# Altium schematic sheet 5_Sensors.schdoc
size 309 x 223 mm; Symbol: Sheet-Symbol_A4; Device: Sheet-Symbol_A4; Company: EasyEDA.com; Drawed: EasyEDA Pro; Reviewed: EasyEDA Pro; Version: V0.1; Page Size: A4; @Project Name: Robomama_ver000; @Page Count: 5; @Update Date: 2024-01-21; @Create Date: 2024-01-14; @Schematic Name: Robomama_Schematic; Part Number: JLCPCB-002; @Page No: 5; @Page Name: Sensors
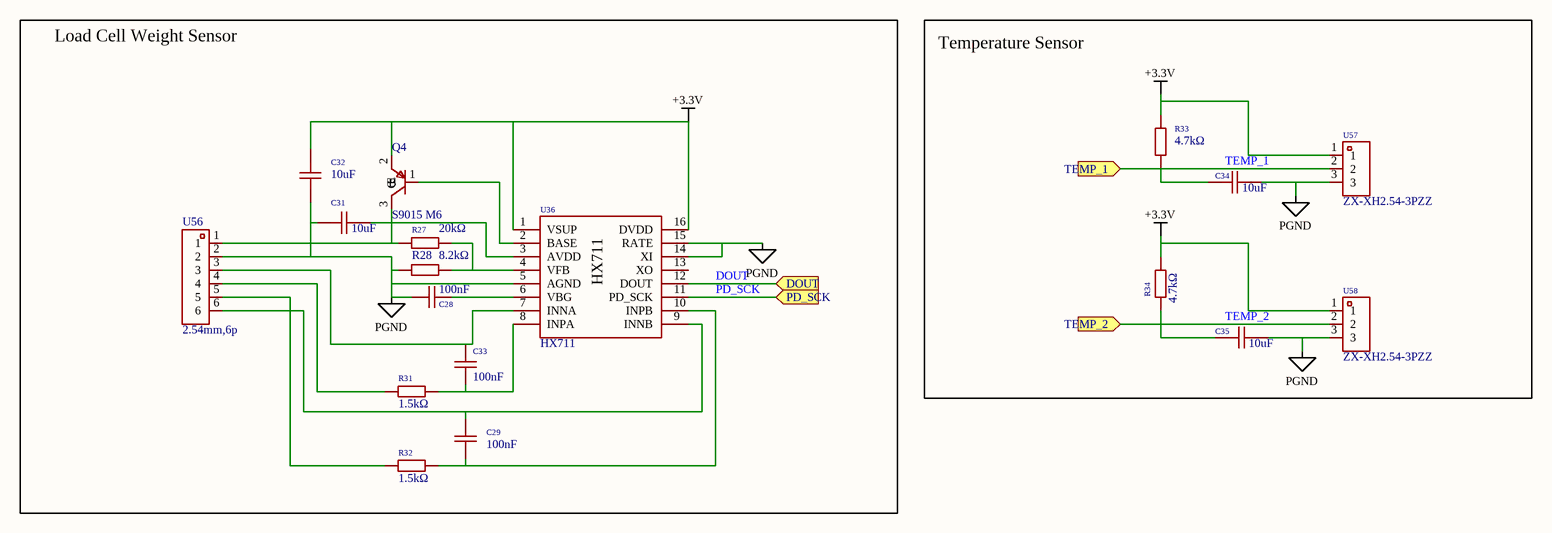
[diagram p0: 5_Sensors.schdoc]

## Parts
C28  100nF  [C0603]  (value not drawn)
C29  100nF  [C0603]  (value not drawn)
C31  10uF  [C0603]  (value not drawn)
C32  10uF  [C0603]  (value not drawn)
C33  100nF  [C0603]  (value not drawn)
C34  10uF  [C0603]  (value not drawn)
C35  10uF  [C0603]  (value not drawn)
Q4  S9015 M6  [SOT-23-3_L2.9-W1.3-P1.90-LS2.4-BR]  (value not drawn)
R27  20kΩ  [R0603]  (value not drawn)
R28  8.2kΩ  [R0603]  (value not drawn)
R31  1.5kΩ  [R0402]  (value not drawn)
R32  1.5kΩ  [R0402]  (value not drawn)
R33  4.7kΩ  [R0402]  (value not drawn)
R34  4.7kΩ  [R0402]  (value not drawn)
U36  HX711  [SOP-16_L10.0-W3.9-P1.27-LS6.0-BL]  (value not drawn)
U56  2.54mm,6p  [HDR-TH_6P-P2.54-V-M-A]  (value not drawn)
U57  ZX-XH2.54-3PZZ  [CONN-TH_3P-P2.54_2501S-3P]  (value not drawn)
U58  ZX-XH2.54-3PZZ  [CONN-TH_3P-P2.54_2501S-3P]  (value not drawn)

## Blocks framed on the sheet
Load Cell Weight Sensor: C28 C29 C31-C33 Q4 R27 R28 R31 R32 U36 U56
Temperature Sensor: C34 C35 R33 R34 U57 U58

## Ports
DOUT (in), PD_SCK (in), TEMP_1 (in), TEMP_2 (in)

## Nets
+3.3V: C32.2 Q4.2(E) R33.1 R34.2 U36.1(VSUP) U36.16(DVDD) U57.1 U58.1
PGND: C28.1 C31.1 C32.1 C34.2 C35.2 R28.1 U36.5(AGND) U36.14(XI) U36.15(RATE) U56.2 U57.3 U58.3
DOUT: U36.12(DOUT) ; port DOUT
PD_SCK: U36.11(PD_SCK) ; port PD_SCK
TEMP_1: C34.1 R33.2 U57.2 ; port TEMP_1
TEMP_2: C35.1 R34.1 U58.2 ; port TEMP_2
NetC28_2: C28.2 U36.6(VBG)
NetC29_1: C29.1 R32.2 U36.10(INPB)
NetC29_2: C29.2 U36.9(INNB) U56.6
NetC31_2: C31.2 Q4.3(C) R27.1 U36.3(AVDD) U56.1
NetC33_1: C33.1 R31.2 U36.8(INPA)
NetC33_2: C33.2 U36.7(INNA) U56.3
NetQ4_1: Q4.1(B) U36.2(BASE)
NetR27_2: R27.2 R28.2 U36.4(VFB)
NetR31_1: R31.1 U56.4
NetR32_1: R32.1 U56.5

Not connected (* = marked no-connect by the designer): U36 13(XO)

## Notes on the sheet
- 1
- 2
- 3
- 4
- 5
- 6
- A
- B
- C
- Schematic
- Robomama_Schematic
- Create Date
- Update Date
- 2024-01-21
- 2024-01-14
- Reviewed
- Drawed
- Page
- EasyEDA Pro
- Sensors
- Part Number
- Robomama_ver000
- JLCPCB-002
- D
- VER
- SIZE
- PAGE
- OF
- V0.1
- A4
- EasyEDA.com

## Library data of the parts
C28 C29 C33 = 0603B104K500NT_C30926: Capacitance: Tolerance:±10% Tolerance:±10% Voltage Rated: Temperature Coefficient:; Manufacturer: FH(风华); Add into BOM: yes; Tolerance: ±10%; Symbol: 0603B104K500NT; Device: 0603B104K500NT_C30926; Supplier: LCSC; Manufacturer Part: 0603B104K500NT; Value: 100nF; Supplier Part: C30926; JLCPCB Part Class: Extended Part; LCSC Part Name: 100nF ±10% 50V; Supplier Footprint: 0603; Datasheet: https://atta.szlcsc.com/upload/public/pdf/source/20200305/C486355_26A10D38EF8C2A5C37091D0039909270.pdf; Convert to PCB: yes
C31 C32 C34 C35 = CL10A106KP8NNNC: Capacitance: Tolerance:±10% Tolerance:±10% Voltage Rated: Temperature Coefficient:; Manufacturer: SAMSUNG(三星); Add into BOM: yes; Tolerance: ±10%; Symbol: CL10A106KP8NNNC; Device: CL10A106KP8NNNC; Supplier: LCSC; Manufacturer Part: CL10A106KP8NNNC; Value: 10uF; Supplier Part: C19702; JLCPCB Part Class: Basic Part; LCSC Part Name: 10uF ±10% 10V; Supplier Footprint: 0603; Datasheet: https://atta.szlcsc.com/upload/public/pdf/source/20160218/1457707763339.pdf; Convert to PCB: yes
Q4 = S9015 M6: Manufacturer: FOSAN(富信); Symbol: S9015_C2926163; Add into BOM: yes; Device: S9015 M6; LCSC Part Name: S9015; Supplier Part: C2926163; Manufacturer Part: S9015 M6; Supplier Footprint: SOT-23; JLCPCB Part Class: Extended Part; Datasheet: https://atta.szlcsc.com/upload/public/pdf/source/20211203/8DB34000D1917A417492DF38B82ACEC8.pdf; Supplier: LCSC; Convert to PCB: yes
R27 = 0603WAF2002T5E: Resistance:20000Ω Tolerance:±1% Tolerance:±1% Power(Watts): Overload Voltage (Max): Temperature Coefficient:±100ppm/℃ Temperature Coefficient:±100ppm/℃ Type:Thick Film Resistors Operating Temperature Range:-55℃~+155℃ Operating Temperature Range:-55℃~+155℃; Manufacturer: UNI-ROYAL(厚声); Add into BOM: yes; Tolerance: ±1%; Symbol: 0603WAF2002T5E; Device: 0603WAF2002T5E; Supplier: LCSC; Manufacturer Part: 0603WAF2002T5E; Supplier Part: C4184; Value: 20kΩ; JLCPCB Part Class: Basic Part; LCSC Part Name: 20kΩ ±1% 100mW 厚膜电阻; Supplier Footprint: 0603; Datasheet: https://atta.szlcsc.com/upload/public/pdf/source/20200306/C422600_1E6D84923E4A46A82E41ADD87F860B5C.pdf; Convert to PCB: yes; Temperature Coefficient: ±100ppm/℃; Type: Thick Film Resistors; Operating Temperature Range: -55℃~+155℃
R28 = RC0603FR-078K2L: Type:Thick Film Resistors Resistance: Tolerance:±1% Tolerance:±1% Power(Watts): Temperature Coefficient:±100ppm/℃ Temperature Coefficient:±100ppm/℃ Overload Voltage (Max): Operating Temperature Range:-55℃~+155℃ Operating Temperature Range:-55℃~+155℃; Manufacturer: YAGEO(国巨); Add into BOM: yes; Tolerance: ±1%; Symbol: RC0603FR-078K2L; Device: RC0603FR-078K2L; LCSC Part Name: 8.2kΩ ±1% 100mW; Supplier Part: C114637; Manufacturer Part: RC0603FR-078K2L; Supplier Footprint: 0603; JLCPCB Part Class: Extended Part; Datasheet: https://atta.szlcsc.com/upload/public/pdf/source/20170912/C114637_1505207799594963452.pdf; Supplier: LCSC; Convert to PCB: yes; Type: Thick Film Resistors; Value: 8.2kΩ; Temperature Coefficient: ±100ppm/℃; Operating Temperature Range: -55℃~+155℃
R31 R32 = 0402WGJ0152TCE: Resistance:1500Ω Tolerance:±5% Tolerance:±5% Power(Watts): Overload Voltage (Max): Temperature Coefficient:±100ppm/℃ Temperature Coefficient:±100ppm/℃ Type:Thick Film Resistors Operating Temperature Range:-55℃~+155℃ Operating Temperature Range:-55℃~+155℃; Manufacturer: UNI-ROYAL(厚声); Add into BOM: yes; Tolerance: ±5%; Symbol: 0402WGJ0152TCE; Device: 0402WGJ0152TCE; Supplier: LCSC; Manufacturer Part: 0402WGJ0152TCE; Supplier Part: C25930; Value: 1.5kΩ; JLCPCB Part Class: Extended Part; LCSC Part Name: 1.5kΩ ±5% 62.5mW 厚膜电阻; Supplier Footprint: 0402; Datasheet: https://atta.szlcsc.com/upload/public/pdf/source/20200306/C422600_1E6D84923E4A46A82E41ADD87F860B5C.pdf; Convert to PCB: yes; Temperature Coefficient: ±100ppm/℃; Type: Thick Film Resistors; Operating Temperature Range: -55℃~+155℃
R33 R34 = 0402WGF4701TCE: Resistance:4700Ω Tolerance:±1% Tolerance:±1% Power(Watts): Overload Voltage (Max): Temperature Coefficient:±100ppm/℃ Temperature Coefficient:±100ppm/℃ Type:Thick Film Resistors Operating Temperature Range:-55℃~+155℃ Operating Temperature Range:-55℃~+155℃; Manufacturer: UNI-ROYAL(厚声); Add into BOM: yes; Tolerance: ±1%; Symbol: 0402WGF4701TCE; Device: 0402WGF4701TCE; Supplier: LCSC; Manufacturer Part: 0402WGF4701TCE; Supplier Part: C25900; Value: 4.7kΩ; JLCPCB Part Class: Basic Part; LCSC Part Name: 4.7kΩ ±1% 62.5mW 厚膜电阻; Supplier Footprint: 0402; Datasheet: https://atta.szlcsc.com/upload/public/pdf/source/20200306/C422600_1E6D84923E4A46A82E41ADD87F860B5C.pdf; Convert to PCB: yes; Temperature Coefficient: ±100ppm/℃; Type: Thick Film Resistors; Operating Temperature Range: -55℃~+155℃
U36 = HX711: Manufacturer: AVIA(海芯科技); Add into BOM: yes; Symbol: HX711; Device: HX711; Supplier: LCSC; Manufacturer Part: HX711; Supplier Part: C43656; JLCPCB Part Class: Extended Part; LCSC Part Name: HX711; Supplier Footprint: SOP-16; Datasheet: https://atta.szlcsc.com/upload/public/pdf/source/20201105/C43656_14FD91CAE53E7DB415D03EABCB162D83.pdf; Convert to PCB: yes
U56 = 长排针,2.54mm,6p: Add into BOM: yes; Symbol: 长排针,2.54MM,6P; Device: 长排针,2.54mm,6p; LCSC Part Name: 长排针,2.54mm,6p; Supplier Part: C9900021383; Manufacturer Part: 2.54mm,6p; Supplier Footprint: HDR-TH_6P-P2.54-V-M; JLCPCB Part Class: Extended Part; Datasheet: https://atta.szlcsc.comnull; Supplier: LCSC; Convert to PCB: yes
U57 U58 = ZX-XH2.54-3PZZ: Pins Structure:1x3P Pitch:2.54mm Mounting Style:Straight Row Spacing:- Number of Pins:3P Number of Rows:1 Number of PINs Per Row:3 Reference Series:XH Current Rating (Max):3A Contact Material:Brass Contact Plating:Tin Operating Temperature Range:-25℃~+85℃; Manufacturer: Megastar(兆星); Add into BOM: yes; Pins Structure: 1x3P; Pitch: 2.54mm; Number of PINs Per Row: 3; Reference Series: XH; Current Rating (Max): 3A; Symbol: ZX-XH2.54-3PZZ; Device: ZX-XH2.54-3PZZ; Supplier: LCSC; Supplier Part: C7429633; Manufacturer Part: ZX-XH2.54-3PZZ; JLCPCB Part Class: Extended Part; LCSC Part Name: 1x3P 间距:2.54mm 直插 系列:XH; Supplier Footprint: 插件,P=2.54mm; Datasheet: https://atta.szlcsc.com/upload/public/pdf/source/20230619/AE17037A2CFDBE8D9CBA775D61AD0A84.pdf; Convert to PCB: yes; Mounting Style: Straight; Row Spacing: -; Number of Pins: 3P; Number of Rows: 1; Contact Material: Brass; Contact Plating: Tin; Operating Temperature Range: -25℃~+85℃